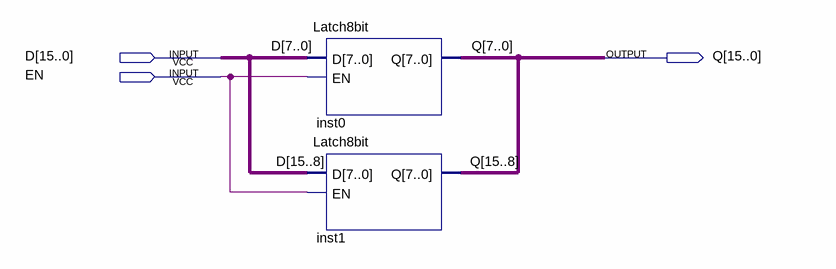
[diagram p0: schematic sheet]
// Quartus schematic Latch16bit.bdf as structural Verilog: 2 symbols, 3 pins
module Latch16bit (
  input  [15:0] D,
  input  EN,
  output [15:0] Q
);

  Latch8bit inst0 (.D(D[7:0]), .EN(EN), .Q(Q[7:0]));
  Latch8bit inst1 (.D(D[15:8]), .EN(EN), .Q(Q[15:8]));
endmodule
